# EAGLE design BrunO2_ControlBoard_v1 (EAGLE 9.6.0)
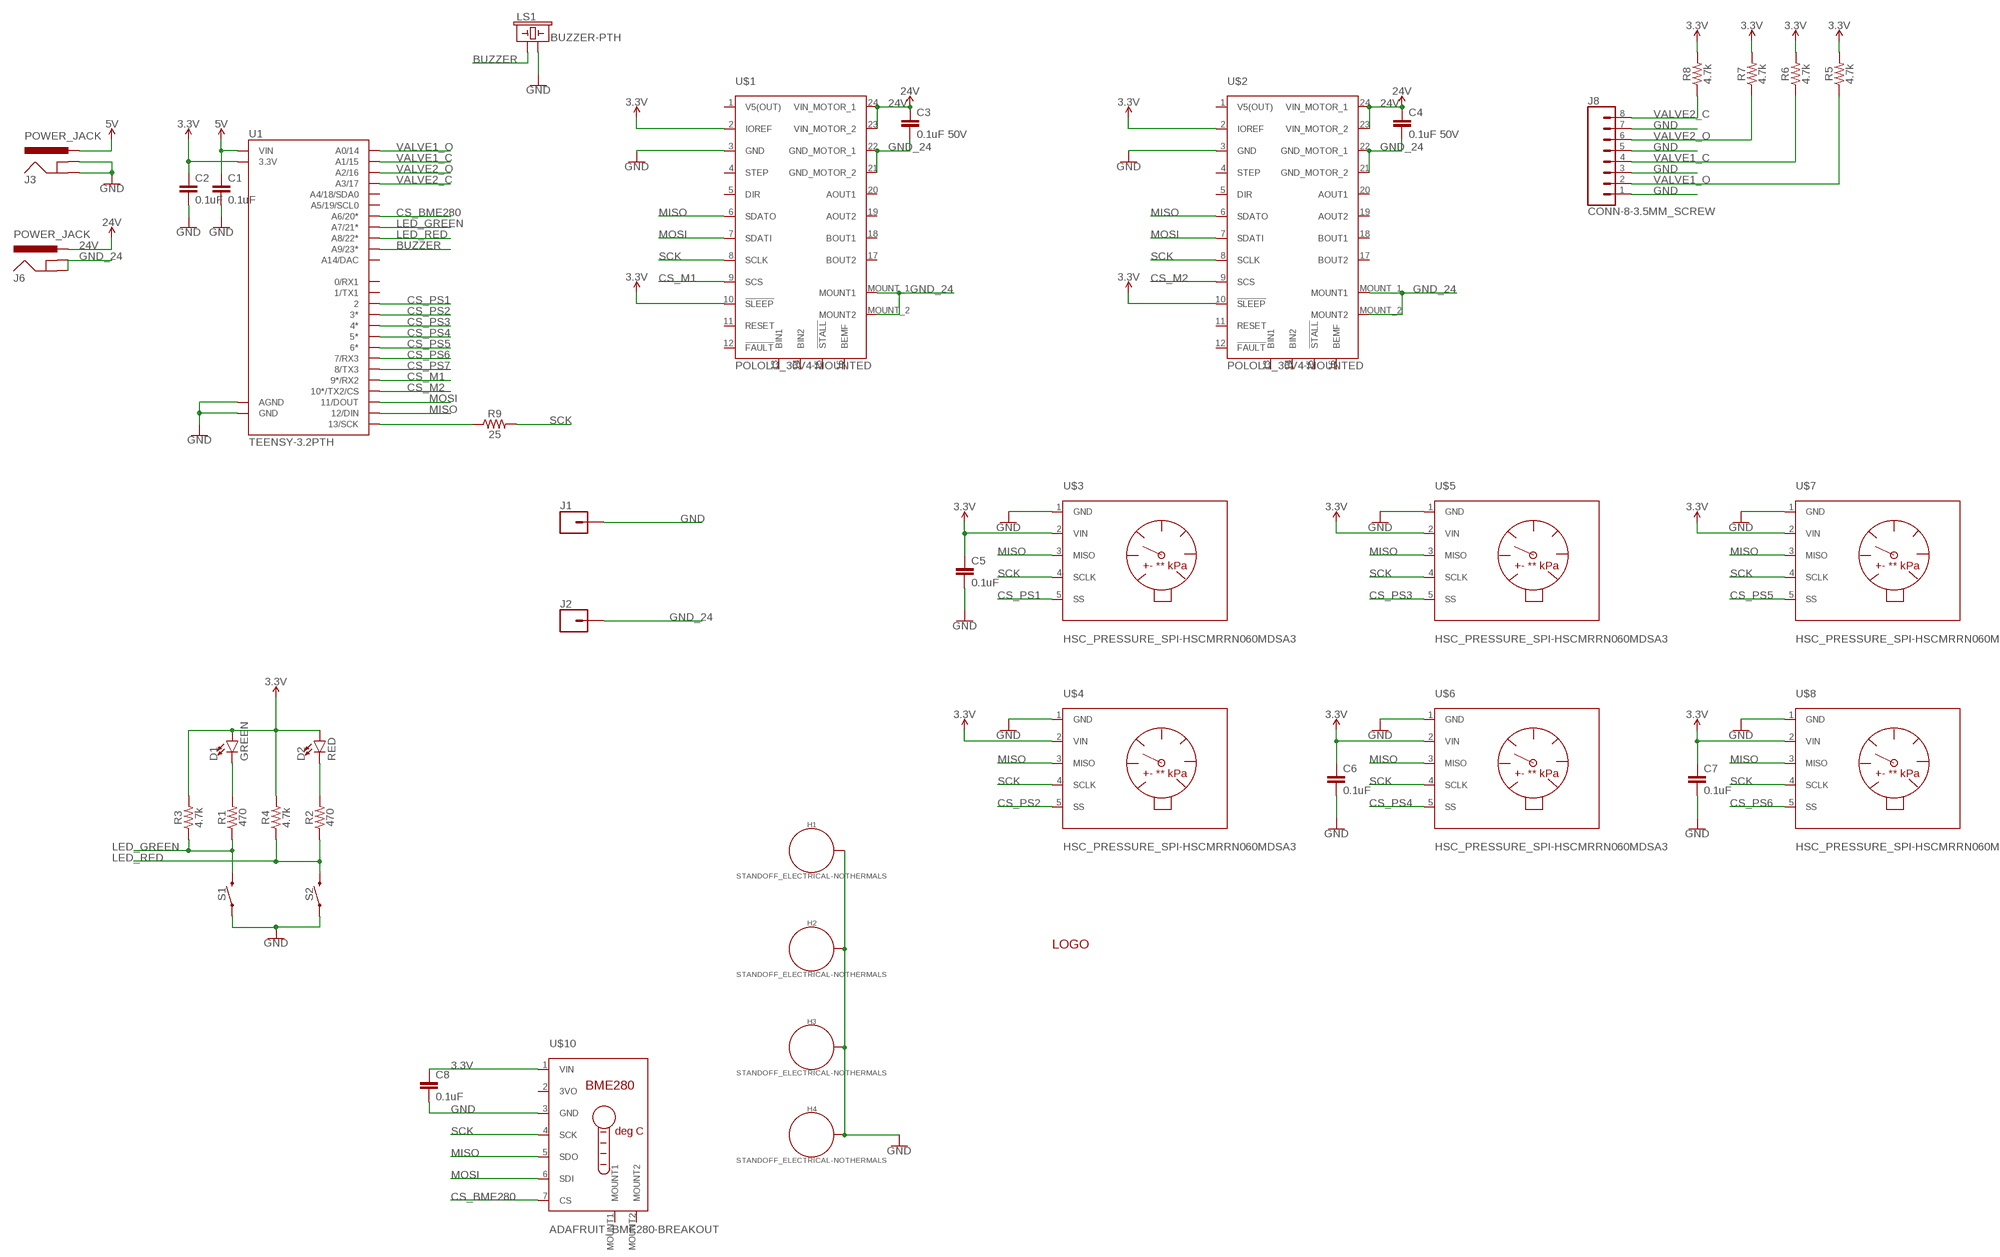
[diagram p0: schematic, sheet 1, part 1 of 2]
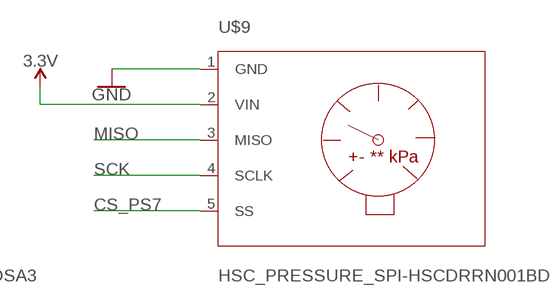
[diagram p1: schematic, sheet 1, part 2 of 2]

## Parts
C1  0.1uF  0.1UF-KIT-EZ-50V-20%  [CAP-PTH-SMALL-KIT]
C2  0.1uF  0.1UF-KIT-EZ-50V-20%  [CAP-PTH-SMALL-KIT]
C3  0.1uF 50V  0.1UF-KIT-EZ-50V-20%  [CAP-PTH-SMALL-KIT]
C4  0.1uF 50V  0.1UF-KIT-EZ-50V-20%  [CAP-PTH-SMALL-KIT]
C5  0.1uF  0.1UF-KIT-EZ-50V-20%  [CAP-PTH-SMALL-KIT]
C6  0.1uF  0.1UF-KIT-EZ-50V-20%  [CAP-PTH-SMALL-KIT]
C7  0.1uF  0.1UF-KIT-EZ-50V-20%  [CAP-PTH-SMALL-KIT]
C8  0.1uF  0.1UF-KIT-EZ-50V-20%  [CAP-PTH-SMALL-KIT]
D1  GREEN  LED-5MM-KIT-NO-SILK  [LED_5MM-KIT-NO-SILK]
D2  RED  LED-5MM-KIT-NO-SILK  [LED_5MM-KIT-NO-SILK]
H1  STANDOFF_ELECTRICAL-NOTHERMALS  [STANDOFF-ELECTRICAL-NOTHERMALS]
H2  STANDOFF_ELECTRICAL-NOTHERMALS  [STANDOFF-ELECTRICAL-NOTHERMALS]
H3  STANDOFF_ELECTRICAL-NOTHERMALS  [STANDOFF-ELECTRICAL-NOTHERMALS]
H4  STANDOFF_ELECTRICAL-NOTHERMALS  [STANDOFF-ELECTRICAL-NOTHERMALS]
J1  CONN_01  [1X01]
J2  CONN_01  [1X01]
J3  POWER_JACK  [POWER_JACK_PTH]
J6  POWER_JACK  [POWER_JACK_PTH]
J8  CONN-8-3.5MM_SCREW  [SCREWTERMINAL-3.5MM-8]
LS1  BUZZER-PTH  [BUZZER-12MM]
R1  470  RESISTORAXIAL-0.3  [AXIAL-0.3]
R2  470  RESISTORAXIAL-0.3  [AXIAL-0.3]
R3  4.7k  RESISTORAXIAL-0.3  [AXIAL-0.3]
R4  4.7k  RESISTORAXIAL-0.3  [AXIAL-0.3]
R5  4.7k  RESISTORAXIAL-0.3  [AXIAL-0.3]
R6  4.7k  RESISTORAXIAL-0.3  [AXIAL-0.3]
R7  4.7k  RESISTORAXIAL-0.3  [AXIAL-0.3]
R8  4.7k  RESISTORAXIAL-0.3  [AXIAL-0.3]
R9  25  RESISTORAXIAL-0.3  [AXIAL-0.3]
S1  MOMENTARY-SWITCH-SPST-PTH-6.0MM  [TACTILE_SWITCH_PTH_6.0MM]
S2  MOMENTARY-SWITCH-SPST-PTH-6.0MM  [TACTILE_SWITCH_PTH_6.0MM]
U1  TEENSY-3.2PTH  [TEENSY_TEENSY-3.2-PTH]
U$1  POLOLU_36V4-MOUNTED  [POLOLU_36V4]
U$2  POLOLU_36V4-MOUNTED  [POLOLU_36V4]
U$3  HSC_PRESSURE_SPI-HSCMRRN060MDSA3  [HSC_PRESSURE_DIP]
U$4  HSC_PRESSURE_SPI-HSCMRRN060MDSA3  [HSC_PRESSURE_DIP]
U$5  HSC_PRESSURE_SPI-HSCMRRN060MDSA3  [HSC_PRESSURE_DIP]
U$6  HSC_PRESSURE_SPI-HSCMRRN060MDSA3  [HSC_PRESSURE_DIP]
U$7  HSC_PRESSURE_SPI-HSCMRRN060MDSA3  [HSC_PRESSURE_DIP]
U$8  HSC_PRESSURE_SPI-HSCMRRN060MDSA3  [HSC_PRESSURE_DIP]
U$9  HSC_PRESSURE_SPI-HSCDRRN001BDSA3  [HSC_PRESSURE_DIP]
U$10  ADAFRUIT_BME280-BREAKOUT  [ADAFRUIT_BME280]
U$11  LOGO-BRUNO2  [BRUNO2_LOGO]

## Nets
3.3V: C2.1 C5.1 C6.1 C7.1 C8.1 D1.A D2.A R3.P$2 R4.P$2 R5.P$2 R6.P$2 R7.P$2 R8.P$2 U1.3.3V U1.3.3V-1(3.3V) U$1.2(IOREF) U$1.10(!SLEEP) U$2.2(IOREF) U$2.10(!SLEEP) U$3.2(VIN) U$4.2(VIN) U$5.2(VIN) U$6.2(VIN) U$7.2(VIN) U$8.2(VIN) U$9.2(VIN) U$10.1(VIN)
5V: C1.1 J3.PWR U1.VIN
24V: C3.1 C4.1 J6.PWR U$1.23(VIN_MOTOR_2) U$1.24(VIN_MOTOR_1) U$2.23(VIN_MOTOR_2) U$2.24(VIN_MOTOR_1)
BUZZER: LS1.+ U1.23(A9/23*)
CS_BME280: U1.20(A6/20*) U$10.7(CS)
CS_M1: U1.9(9*/RX2) U$1.9(SCS)
CS_M2: U1.10(10*/TX2/CS) U$2.9(SCS)
CS_PS1: U1.2 U$3.5(SS)
CS_PS2: U1.3(3*) U$4.5(SS)
CS_PS3: U1.4(4*) U$5.5(SS)
CS_PS4: U1.5(5*) U$6.5(SS)
CS_PS5: U1.6(6*) U$7.5(SS)
CS_PS6: U1.7(7/RX3) U$8.5(SS)
CS_PS7: U1.8(8/TX3) U$9.5(SS)
GND: C1.2 C2.2 C5.2 C6.2 C7.2 C8.2 H1.P1 H2.P1 H3.P1 H4.P1 J1.1 J3.GND J3.GNDBREAK J8.1 J8.3 J8.5 J8.7 LS1.- S1.1 S2.1 U1.AGND U1.GND U1.GND1(GND) U$1.3(GND) U$2.3(GND) U$3.1(GND) U$4.1(GND) U$5.1(GND) U$6.1(GND) U$7.1(GND) U$8.1(GND) U$9.1(GND) U$10.3(GND)
GND_24: C3.2 C4.2 J2.1 J6.GND J6.GNDBREAK U$1.21(GND_MOTOR_2) U$1.22(GND_MOTOR_1) U$1.MOUNT_1(MOUNT1) U$1.MOUNT_2(MOUNT2) U$2.21(GND_MOTOR_2) U$2.22(GND_MOTOR_1) U$2.MOUNT_1(MOUNT1) U$2.MOUNT_2(MOUNT2)
LED_GREEN: R1.P$1 R3.P$1 S1.3 U1.21(A7/21*)
LED_RED: R2.P$1 R4.P$1 S2.3 U1.22(A8/22*)
MISO: U1.12(12/DIN) U$1.6(SDATO) U$2.6(SDATO) U$3.3(MISO) U$4.3(MISO) U$5.3(MISO) U$6.3(MISO) U$7.3(MISO) U$8.3(MISO) U$9.3(MISO) U$10.5(SDO)
MOSI: U1.11(11/DOUT) U$1.7(SDATI) U$2.7(SDATI) U$10.6(SDI)
N$1: D1.K(C) R1.P$2
N$2: R9.P$1 U1.13(13/SCK)
N$4: D2.K(C) R2.P$2
SCK: R9.P$2 U$1.8(SCLK) U$2.8(SCLK) U$3.4(SCLK) U$4.4(SCLK) U$5.4(SCLK) U$6.4(SCLK) U$7.4(SCLK) U$8.4(SCLK) U$9.4(SCLK) U$10.4(SCK)
VALVE1_C: J8.4 R6.P$1 U1.15(A1/15)
VALVE1_O: J8.2 R5.P$1 U1.14(A0/14)
VALVE2_C: J8.8 R8.P$1 U1.17(A3/17)
VALVE2_O: J8.6 R7.P$1 U1.16(A2/16)
Unconnected: U1.0(0/RX1) U1.1(1/TX1) U1.18(A4/18/SDA0) U1.19(A5/19/SCL0) U1.A14/DAC U$1.1(V5(OUT)) U$1.4(STEP) U$1.5(DIR) U$1.11(RESET) U$1.12(!FAULT) U$1.13(BIN1) U$1.14(BIN2) U$1.15(!STALL) U$1.16(BEMF) U$1.17(BOUT2) U$1.18(BOUT1) U$1.19(AOUT2) U$1.20(AOUT1) U$2.1(V5(OUT)) U$2.4(STEP) U$2.5(DIR) U$2.11(RESET) U$2.12(!FAULT) U$2.13(BIN1) U$2.14(BIN2) U$2.15(!STALL) U$2.16(BEMF) U$2.17(BOUT2) U$2.18(BOUT1) U$2.19(AOUT2) U$2.20(AOUT1) U$10.2(3VO) U$10.MOUNT1 U$10.MOUNT2

## Library data of the parts
C1 C2 C5-C8 = SparkFun-Capacitors:0.1UF: 0.1µF ceramic capacitors A capacitor is a passive two-terminal electrical component used to store electrical energy temporarily in an electric field.; PROD_ID: CAP-08370
C3 C4 = SparkFun-Capacitors:0.1UF: 0.1µF ceramic capacitors A capacitor is a passive two-terminal electrical component used to store electrical energy temporarily in an electric field.; PROD_ID: CAP-08370; VALUE: 0.1uF
D1 D2 = SparkFun-LED:LED: LED (Generic) Standard schematic elements and footprints for 5mm, 3mm, 1206, and 0603 sized LEDs. Generic LEDs with no color specified.
H1-H4 = SparkFun-Hardware:STANDOFF_ELECTRICAL: Stand Off Drill holes with an electrical connection. For example, use these to ground your board to a chassis. Example SparkFun Products Screw - Phillips Head (1/4", 4-40, 10 pack) <https://www.sparkfun.com/products/10453> (PRT-10453) Screw - Phillips Head (1/2", 4-40, 10 pack) <https://www.sparkfun.com/products/10452> (PRT-10452) Screw - Phillips Head (3/4", 4-40, 10 pack) <https://www.sparkfun.com/products/10451> (PRT-10451) Screw - Phillips Head (1", 4-40, 10 pack) <https://www.sparkfun.com/products/10450> (PRT-10450)
J1 J2 = SparkFun-Connectors:CONN_01: Single connection point. Often used as Generic Header-pin footprint for 0.1 inch spaced/style header connections On any of the 0.1 inch spaced packages, you can populate with these: Break Away Headers - Straight <https://www.sparkfun.com/products/116> (PRT-00116) Break Away Male Headers - Right Angle <https://www.sparkfun.com/products/553> (PRT-00553) Female Headers <https://www.sparkfun.com/products/115> (PRT-00115) Break Away Headers - Machine Pin <https://www.sparkfun.com/products/117> (PRT-00117) Break Away Female Headers - Swiss Machine Pin <https://www.sparkfun.com/products/743> (PRT-00743) This device is also useful as a general connection point to wire up your design to another part of your project. Our various solder wires solder well into these plated through hole pads. Hook-Up Wire - Assortment (Stranded, 22 AWG) <https://www.sparkfun.com/products/11375> (PRT-11375) Hook-Up Wire - Assortment (Solid Core, 22 AWG) <https://www.sparkfun.com/products/11367> (PRT-11367) View the entire wire category on our website here <https://www.sparkfun.com/categories/141> Special notes: SMTSO-256-ET is a "flush mount" nut for a 4-40 screw. We mostly use this on specialty testbeds; it is a nice way to connect hardware to your PCB at an adjustable hieght. Also note, the SNAP packages are for using a snappable style connector. We sell a baggie of snaps and they are also used on two LilyPad designs: Snap Assortment - 30 pack (male and female) <https://www.sparkfun.com/products/11347> (DEV-11347) LilyPad Arduino SimpleSnap <https://www.sparkfun.com/products/10941> (DEV-10941) LilyPad SimpleSnap Protoboard <https://www.sparkfun.com/products/10940> (DEV-10940)
J3 J6 = SparkFun-Connectors:POWER_JACK: Power Jack Connector This is the standard 5.5mm barrel jack for power. The PTH is the most common, proven, reliable, footprint. The Slot footprint only works if the mill layer is transmitted to the PCB fab house so be warned. Here are the connectors we sell at SparkFun: DC Barrel Power Jack/Connector <https://www.sparkfun.com/products/119> (PRT-00119) DC Barrel Power Jack/Connector (SMD) <https://www.sparkfun.com/products/12748> (PRT-12748) DC Barrel Jack Adapter - Breadboard Compatible <https://www.sparkfun.com/products/10811> (PRT-10811) It is used on this SparkFun product (and many, many others): SparkFun RedBoard - Programmed with Arduino <https://www.sparkfun.com/products/12757> (DEV-12757) Also, if you need a mating power supply or connector, please check these out: Wall Adapter Power Supply - 9VDC 650mA <https://www.sparkfun.com/products/298> (TOL-00298) DC Barrel Jack Adapter - Male <https://www.sparkfun.com/products/10287> (PRT-10287); PROD_ID: CONN-08197
J8 = SchematicsOnly:CONN-8: 8 pin connector. Copied from Sparkfun library
LS1 = SparkFun-Electromechanical:BUZZER: Buzzer Small round buzzers that operate around the audible 2kHz range. You can use these as speakers to create simple music or user interfaces. Variant Overview: PTH - Mini Speaker - PC Mount 12mm 2.048kHz <https://www.sparkfun.com/products/7950> PTH_KIT - Mini Speaker - PC Mount 12mm 2.048kHz <https://www.sparkfun.com/products/7950> KIT simplifies soldering by adding stop mask to one side of the pads. PTH_NO_SILK - Mini Speaker - PC Mount 12mm 2.048kHz <https://www.sparkfun.com/products/7950> No silkscreen indicator of buzzer outline. PTH_KIT_NO_SILK - Mini Speaker - PC Mount 12mm 2.048kHz <https://www.sparkfun.com/products/7950> KIT package w/o silkscreen SMD - Buzzer Audio Magnetic (CCV-084B16) SMD buzzer used on, e.g. the LilyPad Buzzer <https://www.sparkfun.com/products/8463> and RFID USB Reader <https://www.sparkfun.com/products/9963>. SMD_KIT - Buzzer Audio Magnetic (CCV-084B16) SMD Buzzer with elongated pins to make soldering easier. Used on the SparkFun Simon Says - Surface Mount Soldering Kit <https://www.sparkfun.com/products/10935>.; PROD_ID: COMP-08253; SF_SKU: COM-07950
R1-R9 = SparkFun-Resistors:RESISTOR: Generic Resistor Package
S1 S2 = SparkFun-Switches:MOMENTARY-SWITCH-SPST: Momentary Switch (Pushbutton) - SPST Normally-open (NO) SPST momentary switches (buttons, pushbuttons). Variants PTH-12MM - 12mm square, through-hole Momentary Pushbutton Switch - 12mm Square <https://www.sparkfun.com/products/9190> (COM-09190) PTH-6.0MM, PTH-6.0MM-KIT - 6.0mm square, through-hole Mini Pushbutton Switch <https://www.sparkfun.com/products/97> (COM-00097) KIT package intended for soldering kit's - only one side of pads' copper is exposed. PTH-RIGHT-ANGLE-KIT - Right-angle, through-hole Right Angle Tactile Button <https://www.sparkfun.com/products/10791> - Used on SparkFun BigTime Watch Kit <https://www.sparkfun.com/products/11734> SMD-12MM - 12mm square, surface-mount Tactile Button - SMD (12mm) <https://www.sparkfun.com/products/12993> (COM-12993) Used on SparkFun PicoBoard <https://www.sparkfun.com/products/11888> SMD-4.5MM - 4.5mm Square Trackball Switch Used on SparkFun Blackberry Trackballer Breakout <https://www.sparkfun.com/products/13169> SMD-4.6MMX2.8MM - 4.60mm x 2.80mm, surface mount Used on SparkFun SAMD21 Mini Breakout <https://www.sparkfun.com/products/13664> SMD-5.2MM, SMD-5.2-REDUNDANT - 5.2mm square, surface-mount Mini Pushbutton Switch - SMD <https://www.sparkfun.com/products/8720> (COM-08720) Used on Arduino Pro Mini <https://www.sparkfun.com/products/11114> REDUNDANT package connects both switch circuits together SMD-6.0X3.5MM - 6.0 x 3.5mm, surface mount Momentary Reset Switch SMD <https://www.sparkfun.com/products/8229> (COM-08229) SMD-6.2MM-TALL - 6.2mm square, surface mount Tactile Button - SMD (6mm) <https://www.sparkfun.com/products/12992> Used on SparkFun Digital Sandbox <https://www.sparkfun.com/products/12651> SMD-RIGHT-ANGLE - Right-angle, surface mount Used on SparkFun Block for Intel® Edison - Arduino <https://www.sparkfun.com/products/13036>; PROD_ID: SWCH-08441; SF_SKU: COM-00097
U1 = SparkFun-Boards:TEENSY-3.2
U$1 U$2 = SchematicsOnly:POLOLU_36V4
U$3-U$9 = SchematicsOnly:HSC_PRESSURE_SPI
U$10 = SchematicsOnly:ADAFRUIT_BME280: https://github.com/adafruit/Adafruit-BME280-Breakout-PCB Adafruit BME280 breakout
U$11 = SchematicsOnly:LOGO

## Board
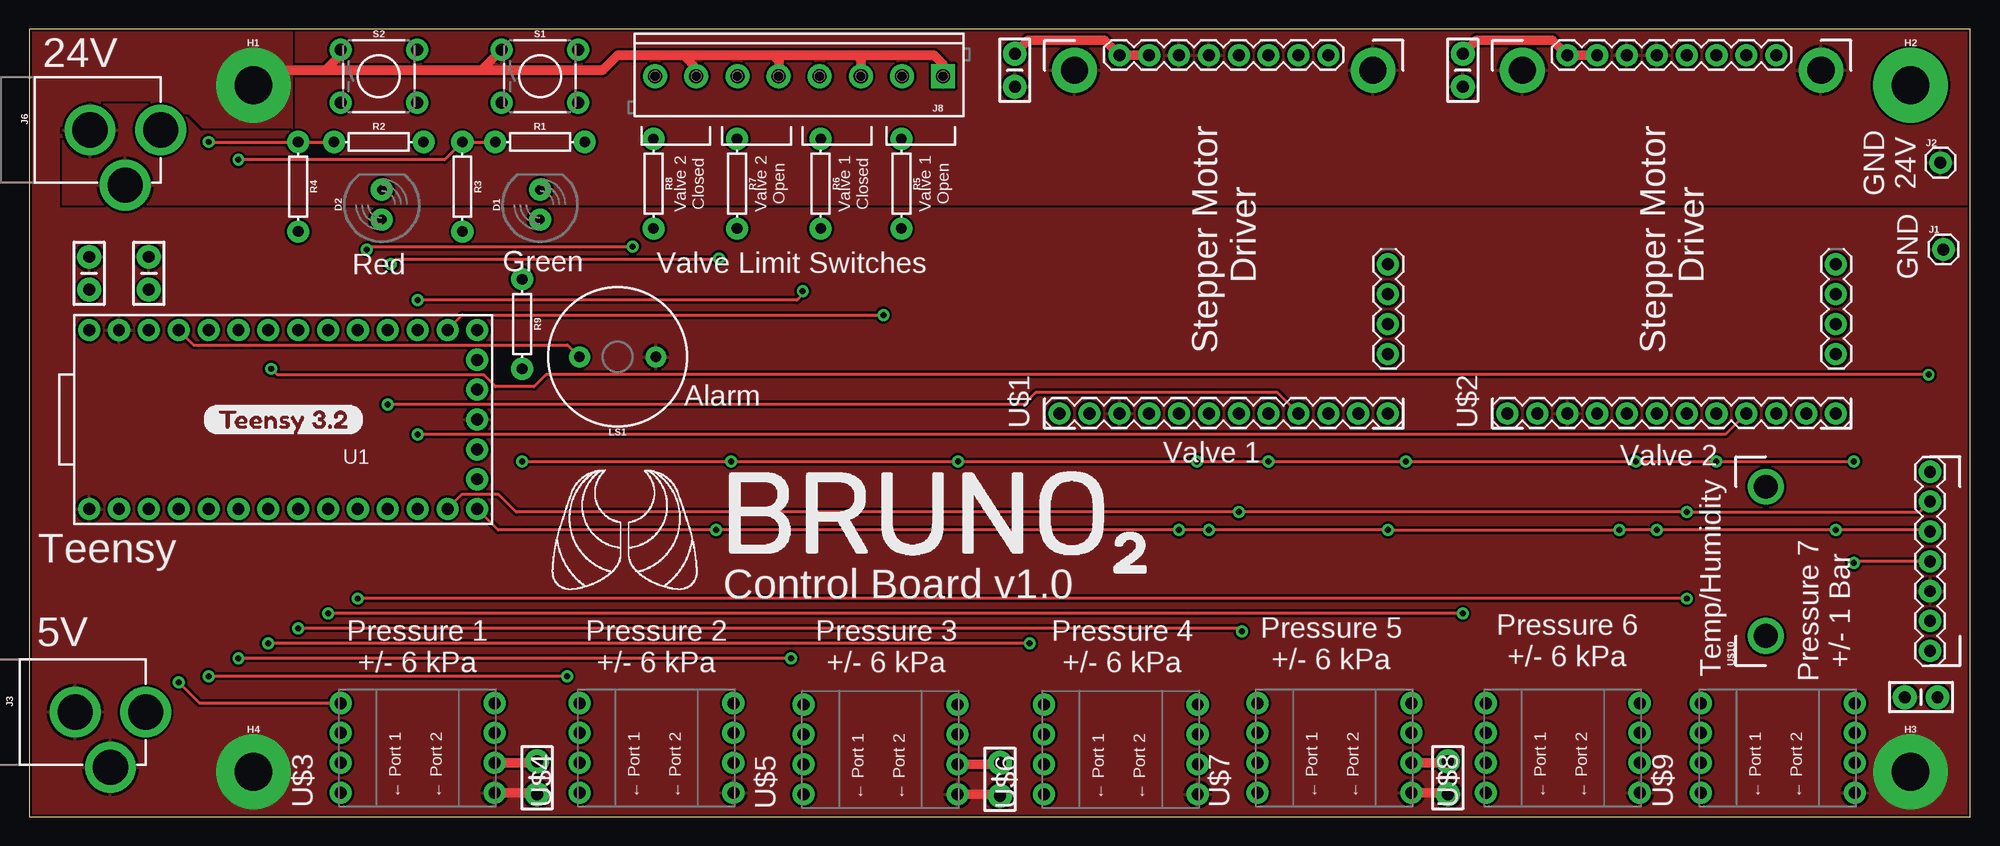
[diagram p2: board, top side]
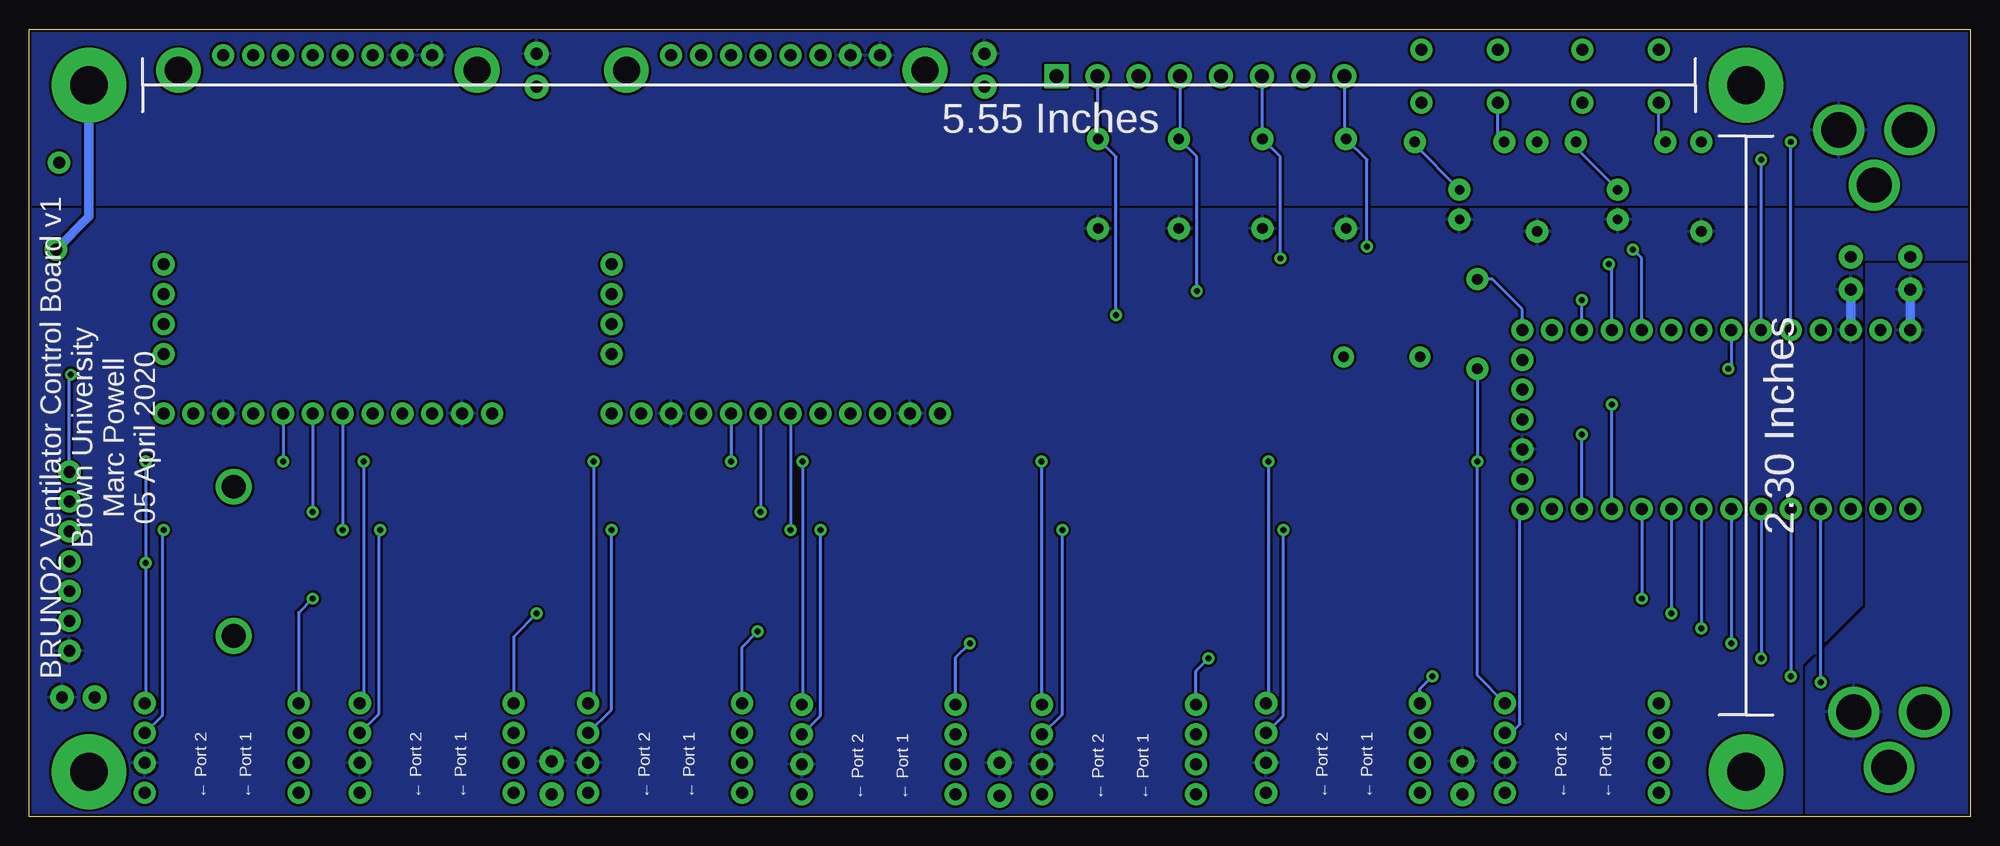
[diagram p3: board, bottom side, seen from below]

Size 165.08 x 66.98 mm. Coordinates in mm from the lower left corner, seen from the top.
Outline: 0,0 165.08,0 165.08,66.98 0,66.98 0,0
Copper layers (1*16): Top 0.035mm / dielectric 1.5mm / Bottom 0.035mm
Design rules "SparkFun": minimum track width 8mil, minimum drill 20mil, track to track 8mil, track to pad 8mil, pad to pad 8mil, via to via 8mil, smd to smd 8mil, copper to edge 8mil, drill to drill 8mil, minimum pad ring 12mil, minimum via ring 10mil, stop-mask expansion 4mil, vias tented up to drill 20mil, thermal gap 10mil

### Footprints (pad centres in the part's own frame; a part is rotated, then mirrored left to right if it is on the bottom)
CAP-PTH-SMALL-KIT = drill 1.016 pad 2.032: 1 -1.397,0; 2 1.397,0
LED_5MM-KIT-NO-SILK = drill 0.813 pad 1.88: A -1.27,0; K 1.27,0
STANDOFF-ELECTRICAL-NOTHERMALS = drill 3.2 pad 6.35: P1 0,0
1X01 = drill 1.016 pad 1.88: 1 0,0
POWER_JACK_PTH = drill 2.997 pad 4.318: GND 0,7.7; GNDBREAK 4.7,10.7; PWR 0,13.7
SCREWTERMINAL-3.5MM-8 = drill 1.2 pad 2.032 square: 1 0,0 | drill 1.2 pad 2.032: 2 3.5,0; 3 7,0; 4 10.5,0; 5 14,0; 6 17.5,0; 7 21,0; 8 24.5,0
BUZZER-12MM = drill 0.9 pad 1.778: + 3.25,0; - -3.25,0
AXIAL-0.3 = drill 0.9 pad 1.88: P$1 -3.81,0; P$2 3.81,0
TACTILE_SWITCH_PTH_6.0MM = drill 1.016 pad 1.88: 1 -3.251,2.261; 2 3.251,2.261; 3 -3.251,-2.261; 4 3.251,-2.261
TEENSY_TEENSY-3.2-PTH = drill 1.016 pad 1.88: 0 -13.97,-7.62; 1 -11.43,-7.62; 2 -8.89,-7.62; 3 -6.35,-7.62; 3.3V 16.51,-2.54; 3.3V-1 -11.43,7.62; 4 -3.81,-7.62; 5 -1.27,-7.62; 6 1.27,-7.62; 7 3.81,-7.62; 8 6.35,-7.62; 9 8.89,-7.62; 10 11.43,-7.62; 11 13.97,-7.62; 12 16.51,-7.62; 13 16.51,7.62; 14 13.97,7.62; 15 11.43,7.62; 16 8.89,7.62; 17 6.35,7.62; 18 3.81,7.62; 19 1.27,7.62; 20 -1.27,7.62; 21 -3.81,7.62; 22 -6.35,7.62; 23 -8.89,7.62; A14/DAC 16.51,5.08; AGND -13.97,7.62; GND 16.51,0; GND1 -16.51,-7.62; PROG 16.51,2.54; VBAT 16.51,-5.08; VIN -16.51,7.62
POLOLU_36V4 = drill 1.016 pad 1.88: 1 -15.24,13.97; 2 -15.24,11.43; 3 -15.24,8.89; 4 -15.24,6.35; 5 -15.24,3.81; 6 -15.24,1.27; 7 -15.24,-1.27; 8 -15.24,-3.81; 9 -15.24,-6.35; 10 -15.24,-8.89; 11 -15.24,-11.43; 12 -15.24,-13.97; 13 -10.16,-13.97; 14 -7.62,-13.97; 15 -5.08,-13.97; 16 -2.54,-13.97; 17 15.24,-8.89; 18 15.24,-6.35; 19 15.24,-3.81; 20 15.24,-1.27; 21 15.24,1.27; 22 15.24,3.81; 23 15.24,6.35; 24 15.24,8.89 | drill 2.3 pad 3.81: MOUNT_1 13.97,-12.7; MOUNT_2 13.97,12.7
HSC_PRESSURE_DIP = drill 1.016 pad 1.88: 1 -3.81,-6.54; 2 -1.27,-6.54; 3 1.27,-6.54; 4 3.81,-6.54; 5 3.81,6.54; 6 1.27,6.54; 7 -1.27,6.54; 8 -3.81,6.54
ADAFRUIT_BME280 = drill 1.016 pad 1.88: 1 1.27,2.54; 2 3.81,2.54; 3 6.35,2.54; 4 8.89,2.54; 5 11.43,2.54; 6 13.97,2.54; 7 16.51,2.54 | drill 2.032: MOUNT1 2.54,16.51; MOUNT2 15.24,16.51

### Placement (x,y rotation side)
C1  5.08,46.23 90 top
C2  10.16,46.23 90 top
C3  83.82,63.5 270 top
C4  121.92,63.5 270 top
C5  43.18,3.3 270 top
C6  82.55,3.17 270 top
C7  120.65,3.3 270 top
C8  160.91,10.16 180 top
D1  43.43,52.07 90 top
D2  29.97,52.07 90 top
H1  19.05,62.23 0 top
H2  160.02,62.23 0 top
H3  160.02,3.81 0 top
H4  19.05,3.81 0 top
J1  162.81,48.26 0 top
J2  162.56,55.63 0 top
J3  -3.81,8.89 270 top
J6  -2.54,58.42 270 top
J8  77.72,62.99 180 top
LS1  50.04,39.12 180 top
R1  43.43,57.4 0 top
R2  29.72,57.4 0 top
R3  36.83,53.59 270 top
R4  22.86,53.59 270 top
R5  74.17,53.85 270 top
R6  67.31,53.85 270 top
R7  60.2,53.85 270 top
R8  53.09,53.85 270 top
R9  41.91,41.91 270 top
S1  43.43,62.99 0 top
S2  29.72,62.99 0 top
U1  21.59,33.78 0 top
U$1  101.6,49.53 90 top
U$2  139.7,49.53 90 top
U$3  33.02,5.84 90 top
U$4  53.34,5.84 90 top
U$5  72.39,5.71 90 top
U$6  92.84,5.71 90 top
U$7  111,5.84 90 top
U$8  130.43,5.84 90 top
U$9  148.72,5.84 90 top
U$10  164.21,12.83 90 top
U$11  44.45,19.3 0 top

### Tracks (layer width: path | path; a pad name or v marks a point on that pad's centre or on a via)
3.3V
  Top 0.813: U$3.2 43.05,4.57 C5.1 | U$5.2 82.42,4.45 C6.1 | U$7.2 120.52,4.57 C7.1
  Bottom 0.813: U1.3.3V-1 C2.1
  pour Bottom (rank 2): 165.1,0 0,0 0,66.93 165.1,66.93
5V
  Bottom 0.813: U1.VIN C1.1
  pour Bottom: 13.97,0 0,0 0,46.99 8.89,46.99 8.89,17.78 13.97,12.7
24V
  Top 0.813: U$1.23 U$1.24 91.44,66.04 84.96,66.04 C3.1 | C4.1 123.06,66.04 129.54,66.04 U$2.24 U$2.23
  pour Bottom: 165.1,52.07 0,52.07 0,66.93 165.1,66.93
BUZZER
  Top 0.254: U1.23 13.97,40.13 45.77,40.13 LS1.+
CS_BME280  (via drill 0.51)
  Top 0.254: v20.57,38.1 21.08,37.59 38.63,37.59 39.64,36.58 42.93,36.58 43.94,37.59 v161.54,37.59
  Bottom 0.254: U1.20 20.32,38.35 v20.57,38.1 | U$10.7 161.67,37.47 v161.54,37.59
CS_M1  (via drill 0.51)
  Top 0.254: U$1.9 106.17,36.07 85.6,36.07 84.58,35.05 v30.48,35.05
  Bottom 0.254: U1.9 v30.48,35.05
CS_M2  (via drill 0.51)
  Top 0.254: v33.02,32.51 144.27,32.51 U$2.9
  Bottom 0.254: U1.10 v33.02,32.51
CS_PS1  (via drill 0.51)
  Top 0.254: U$3.5 14.48,9.65 v12.7,11.43
  Bottom 0.254: v12.7,11.43 U1.2
CS_PS2  (via drill 0.51)
  Top 0.254: v45.72,11.94 v15.24,11.94
  Bottom 0.254: U1.3 v15.24,11.94 | U$4.5 46.8,10.86 v45.72,11.94
CS_PS3  (via drill 0.51)
  Top 0.254: v64.77,13.46 v17.78,13.46
  Bottom 0.254: U1.4 v17.78,13.46 | U$5.5 65.85,12.38 v64.77,13.46
CS_PS4  (via drill 0.51)
  Top 0.254: v85.09,14.73 v20.32,14.73
  Bottom 0.254: U1.5 v20.32,14.73 | U$6.5 86.3,13.53 v85.09,14.73
CS_PS5  (via drill 0.51)
  Top 0.254: v103.12,15.75 102.87,16 v22.86,16
  Bottom 0.254: U1.6 v22.86,16 | U$7.5 104.46,14.41 v103.12,15.75
CS_PS6  (via drill 0.51)
  Top 0.254: v121.92,17.27 v25.4,17.27
  Bottom 0.254: U1.7 v25.4,17.27 | v121.92,17.27 123.89,15.3 U$8.5
CS_PS7  (via drill 0.51)
  Top 0.254: v140.97,18.54 v27.94,18.54
  Bottom 0.254: U1.8 v27.94,18.54 | v140.97,18.54 142.18,17.34 U$9.5
GND
  Top 0.813: U$3.1 43.05,2.03 C5.2 | U$5.1 82.42,1.91 C6.2 | U$7.1 120.52,2.03 C7.2 | 55.63,64.77 50.04,64.77 48.77,63.5 38.43,63.5 | 55.63,64.77 56.72,63.67 J8.7 | 55.63,64.77 63.25,64.77 | 63.25,64.77 63.75,64.26 63.75,63.02 J8.5 | 63.25,64.77 70.36,64.77 | 70.36,64.77 70.72,64.4 J8.3 | 70.36,64.77 76.96,64.77 77.72,64.01 J8.1 | H1.P1 20.32,63.5 25.15,63.5 | 25.15,63.5 38.43,63.5 | S2.1 26.47,64.82 25.15,63.5 | S1.1 38.43,63.5
  Bottom 0.813: H2.P1 160.02,51.05 J1.1
  pour Top (rank 3): 165.1,0 0,0 0,67.06 165.1,67.06
  pour Top: 0,67.06 0,51.31 2.54,51.31 2.54,59.69 3.81,60.96 12.45,60.96 14.73,58.67 22.35,58.67 22.35,67.06
GND_24
  pour Top (rank 2): 165.1,52.07 0,52.07 0,66.93 165.1,66.93
LED_GREEN  (via drill 0.51)
  Top 0.254: R1.P$1 R3.P$1 35.31,55.88 v17.78,55.88
  Bottom 0.254: R1.P$1 40.18,57.96 S1.3 | U1.21 v17.78,55.88
LED_RED  (via drill 0.51)
  Top 0.254: R2.P$1 R4.P$1 v15.24,57.4
  Bottom 0.254: R2.P$1 26.47,57.96 S2.3 | U1.22 v15.24,57.4
MISO  (via drill 0.51)
  Top 0.254: U1.12 39.88,24.38 v58.42,24.38 v77.22,24.38 v97.79,24.38 v100.33,24.38 v115.57,24.38 v135.25,24.38 v138.43,24.38 v153.67,24.38 161.54,24.38 U$10.5
  Bottom 0.254: U$8.3 135.38,8.7 135.38,24.26 v135.25,24.38 | U$7.3 115.57,9.08 v115.57,24.38 | U$6.3 97.79,8.57 v97.79,24.38 | U$5.3 77.22,8.7 v77.22,24.38 | U$4.3 58.42,8.57 v58.42,24.38 | U$3.3 39.03,7.11 38.29,7.86 38.29,25.97 U1.12 | U$2.6 v138.43,24.38 | v153.67,24.38 153.8,24.26 153.8,8.57 U$9.3 | U$1.6 v100.33,24.38
MOSI  (via drill 0.51)
  Top 0.254: U1.11 36.83,27.43 39.88,27.43 41.4,25.91 v102.87,25.91 v140.97,25.91 160.78,25.91 U$10.6
  Bottom 0.254: U$2.7 v140.97,25.91 | U$1.7 v102.87,25.91
N$1
  Bottom 0.254: D1.K 47.24,57.15 R1.P$2
N$2
  Bottom 0.254: U1.13 38.1,43.18 40.64,45.72 R9.P$1
N$4
  Bottom 0.254: D2.K 33.53,56.9 R2.P$2
SCK  (via drill 0.51)
  Top 0.254: v41.91,30.23 v59.69,30.23 v78.99,30.23 v99.31,30.23 v105.41,30.23 v117.09,30.23 v136.65,30.23 v143.51,30.23 v155.19,30.23 | U$10.4 155.32,21.72 v155.19,21.59
  Bottom 0.254: R9.P$2 v41.91,30.23 41.91,12 U$3.4 | v59.69,30.23 59.69,9.84 U$4.4 | v78.99,30.23 78.99,9.59 U$5.4 | v99.31,30.23 99.31,9.59 U$6.4 | v117.09,30.23 117.09,10.1 U$7.4 | v136.65,30.23 136.65,9.97 U$8.4 | U$2.8 v143.51,30.23 | v155.19,30.23 v155.19,21.59 155.19,9.72 U$9.4 | U$1.8 v105.41,30.23
VALVE1_C  (via drill 0.51)
  Top 0.254: v65.79,44.7 65.79,44.45 65.28,43.94 v33.02,43.94
  Bottom 0.254: J8.4 67.22,57.74 R6.P$1 65.79,56.13 v65.79,44.7 | U1.15 v33.02,43.94
VALVE1_O  (via drill 0.51)
  Top 0.254: U1.14 36.83,42.67 v72.64,42.67
  Bottom 0.254: J8.2 74.22,57.71 R5.P$1 72.64,56.13 v72.64,42.67
VALVE2_C  (via drill 0.51)
  Top 0.254: v28.7,48.26 28.96,48.51 v51.31,48.51
  Bottom 0.254: J8.8 53.22,57.8 R8.P$1 51.31,55.88 v51.31,48.51 | U1.17 27.94,47.5 v28.7,48.26
VALVE2_O  (via drill 0.51)
  Top 0.254: v30.73,46.99 31.11,47.37 58.55,47.37 v58.67,47.5
  Bottom 0.254: J8.6 60.22,57.68 R7.P$1 58.67,56.13 v58.67,47.5 | U1.16 30.48,46.74 v30.73,46.99

### Text on the board
tPlace: 24V | GND / 24V | Valve 2 / Closed | Valve 2 / Open | Valve 1 / Closed | Valve 1 / Open | GND | Red | Green | Valve Limit Switches | Alarm | Valve 1 | Valve 2 | Teensy | Control Board v1.0 | Temp/Humidity | Pressure 7 / +/- 1 Bar | 5V | Pressure 5 / +/- 6 kPa | Pressure 6 / +/- 6 kPa | Pressure 1 / +/- 6 kPa | Pressure 2 / +/- 6 kPa | Pressure 3 / +/- 6 kPa | Pressure 4 / +/- 6 kPa
bPlace: 5.55 Inches | 2.30 Inches | BRUNO2 Ventilator Control Board v1 / Brown University / Marc Powell / 05 April 2020